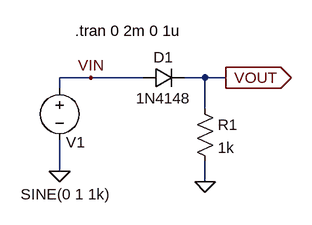
[diagram p0: schematic fig-01-03-11.asc]
fig-01-03-11.asc, the LTspice schematic file:
Version 4
SHEET 1 880 680
WIRE 192 176 144 176
WIRE 272 176 192 176
WIRE 368 176 336 176
WIRE 400 176 368 176
WIRE 144 192 144 176
WIRE 368 224 368 176
WIRE 144 320 144 272
WIRE 368 336 368 304
FLAG 144 320 0
FLAG 400 176 VOUT
IOPIN 400 176 Out
FLAG 192 176 VIN
FLAG 368 336 0
SYMBOL voltage 144 176 R0
WINDOW 0 10 99 Left 2
WINDOW 3 -60 179 Left 2
WINDOW 123 0 0 Left 0
WINDOW 39 0 0 Left 0
SYMATTR InstName V1
SYMATTR Value SINE(0 1 1k)
SYMBOL diode 272 192 R270
WINDOW 0 32 32 VTop 2
WINDOW 3 0 32 VBottom 2
SYMATTR InstName D1
SYMATTR Value 1N4148
SYMBOL res 352 208 R0
SYMATTR InstName R1
SYMATTR Value 1k
TEXT 168 104 Left 2 !.tran 0 2m 0 1u

The netlist it stands for:
* fig-01-03-11.asc
V1 VIN 0 SINE(0 1 1k)
D1 VIN VOUT 1N4148
R1 VOUT 0 1k
.model D D
.lib standard.dio
.tran 0 2m 0 1u
.backanno
.end